# Altium schematic sheet PLL_PCB.SchDoc
size 863 x 558 mm
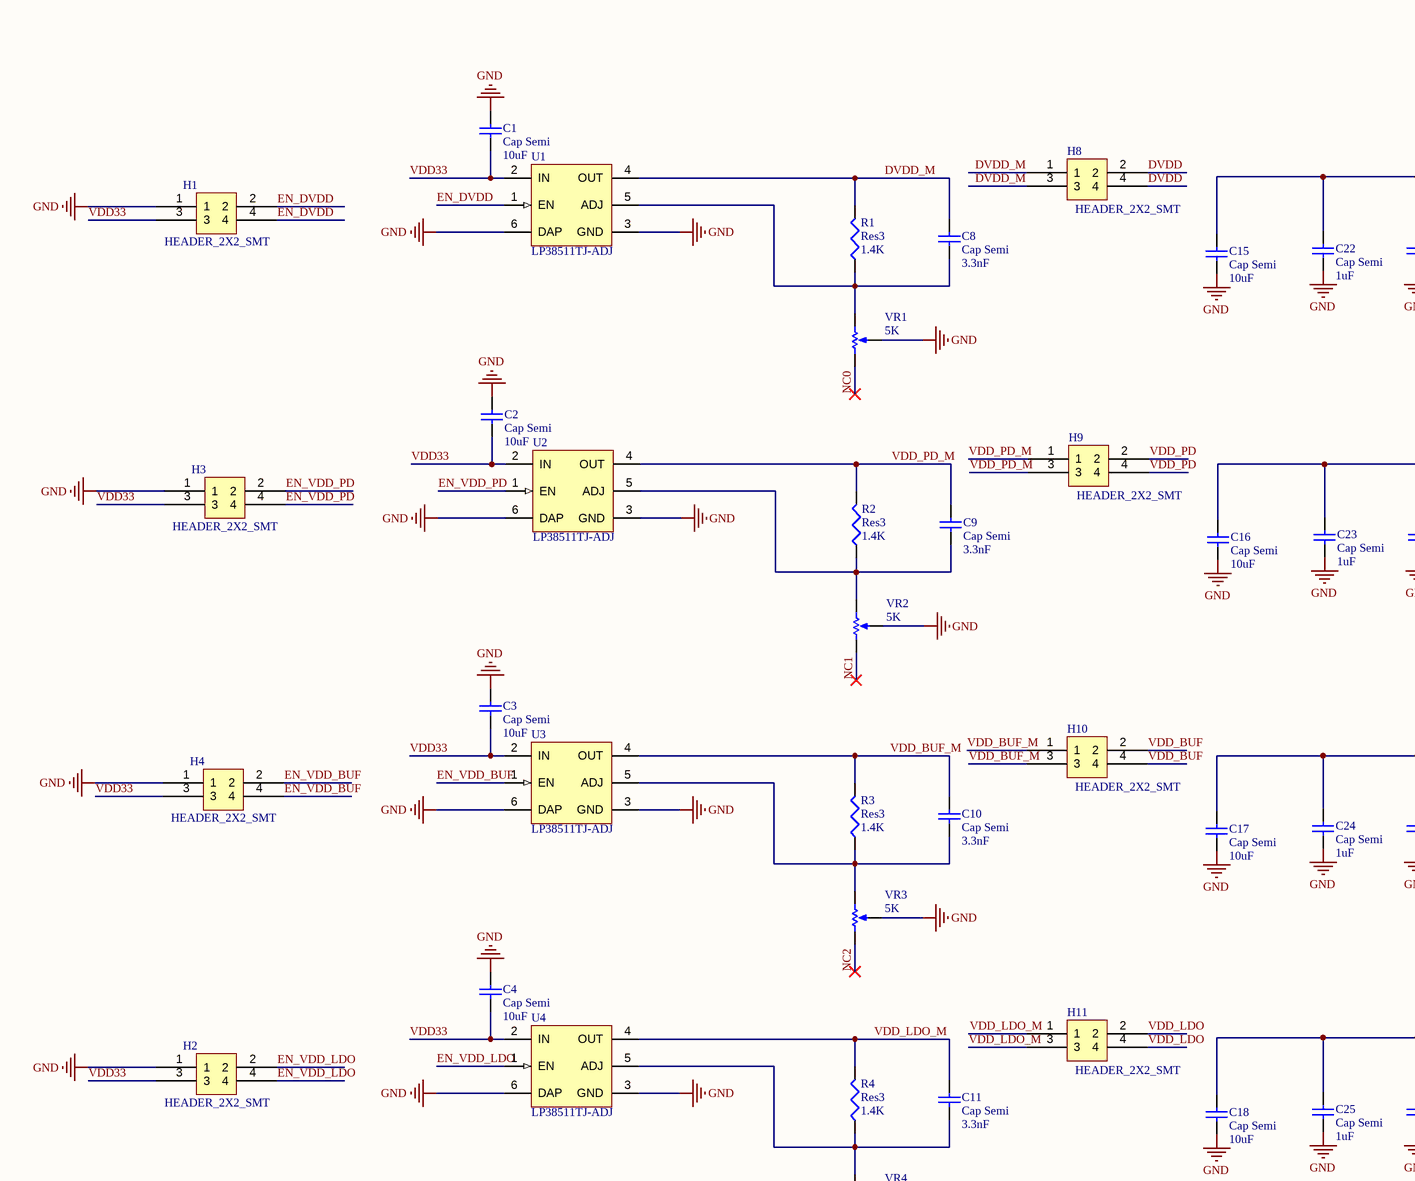
[diagram p0: PLL_PCB.SchDoc, top left]
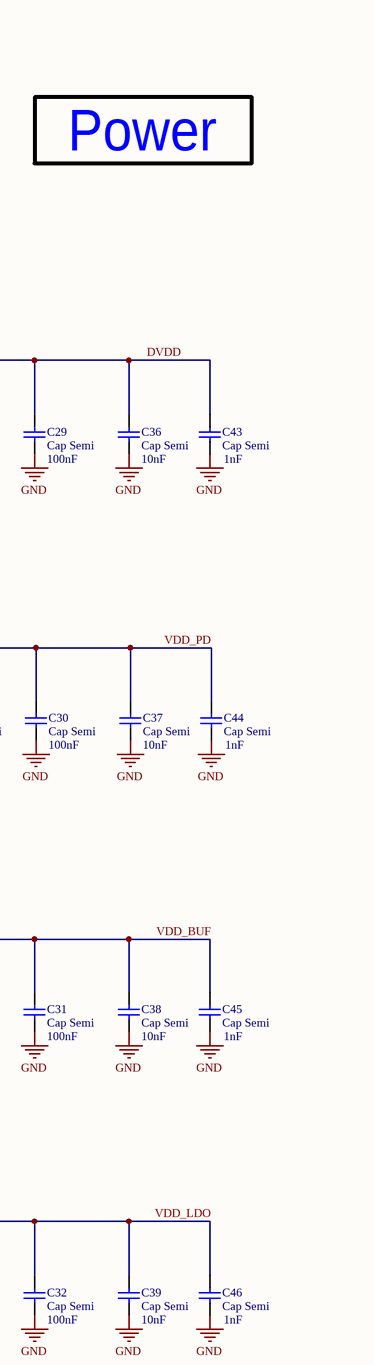
[diagram p1: PLL_PCB.SchDoc, top middle]
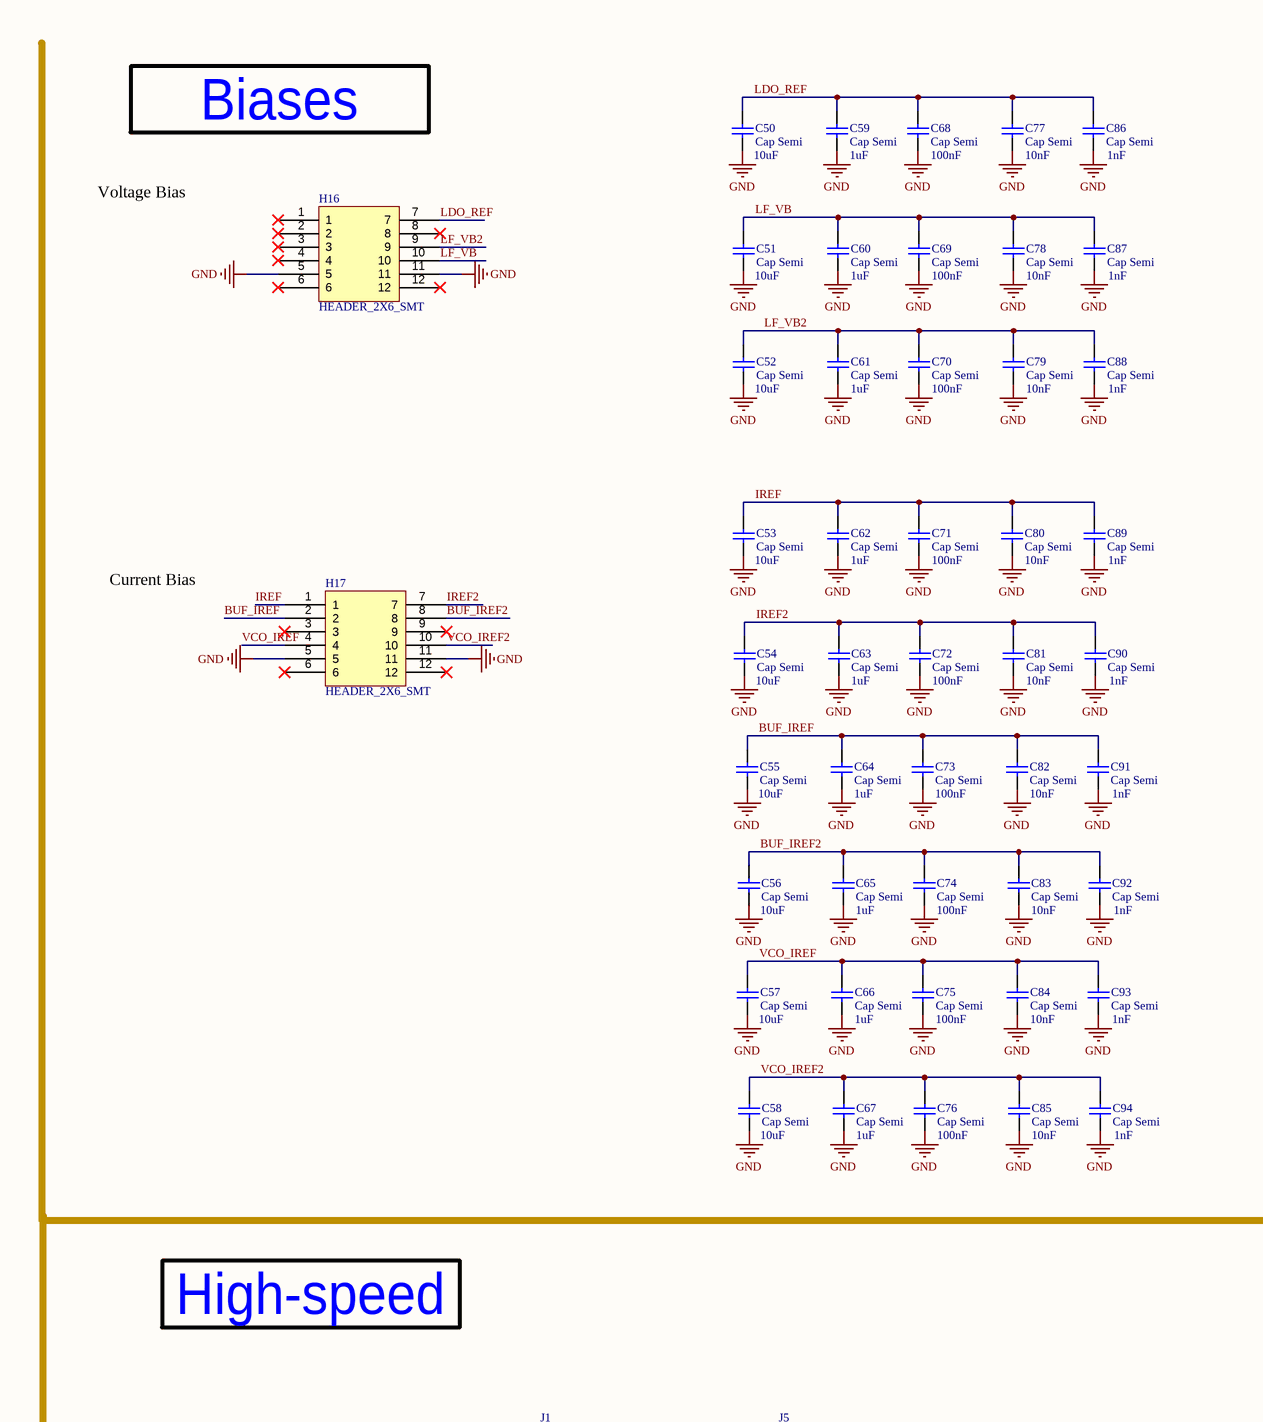
[diagram p2: PLL_PCB.SchDoc, top right]
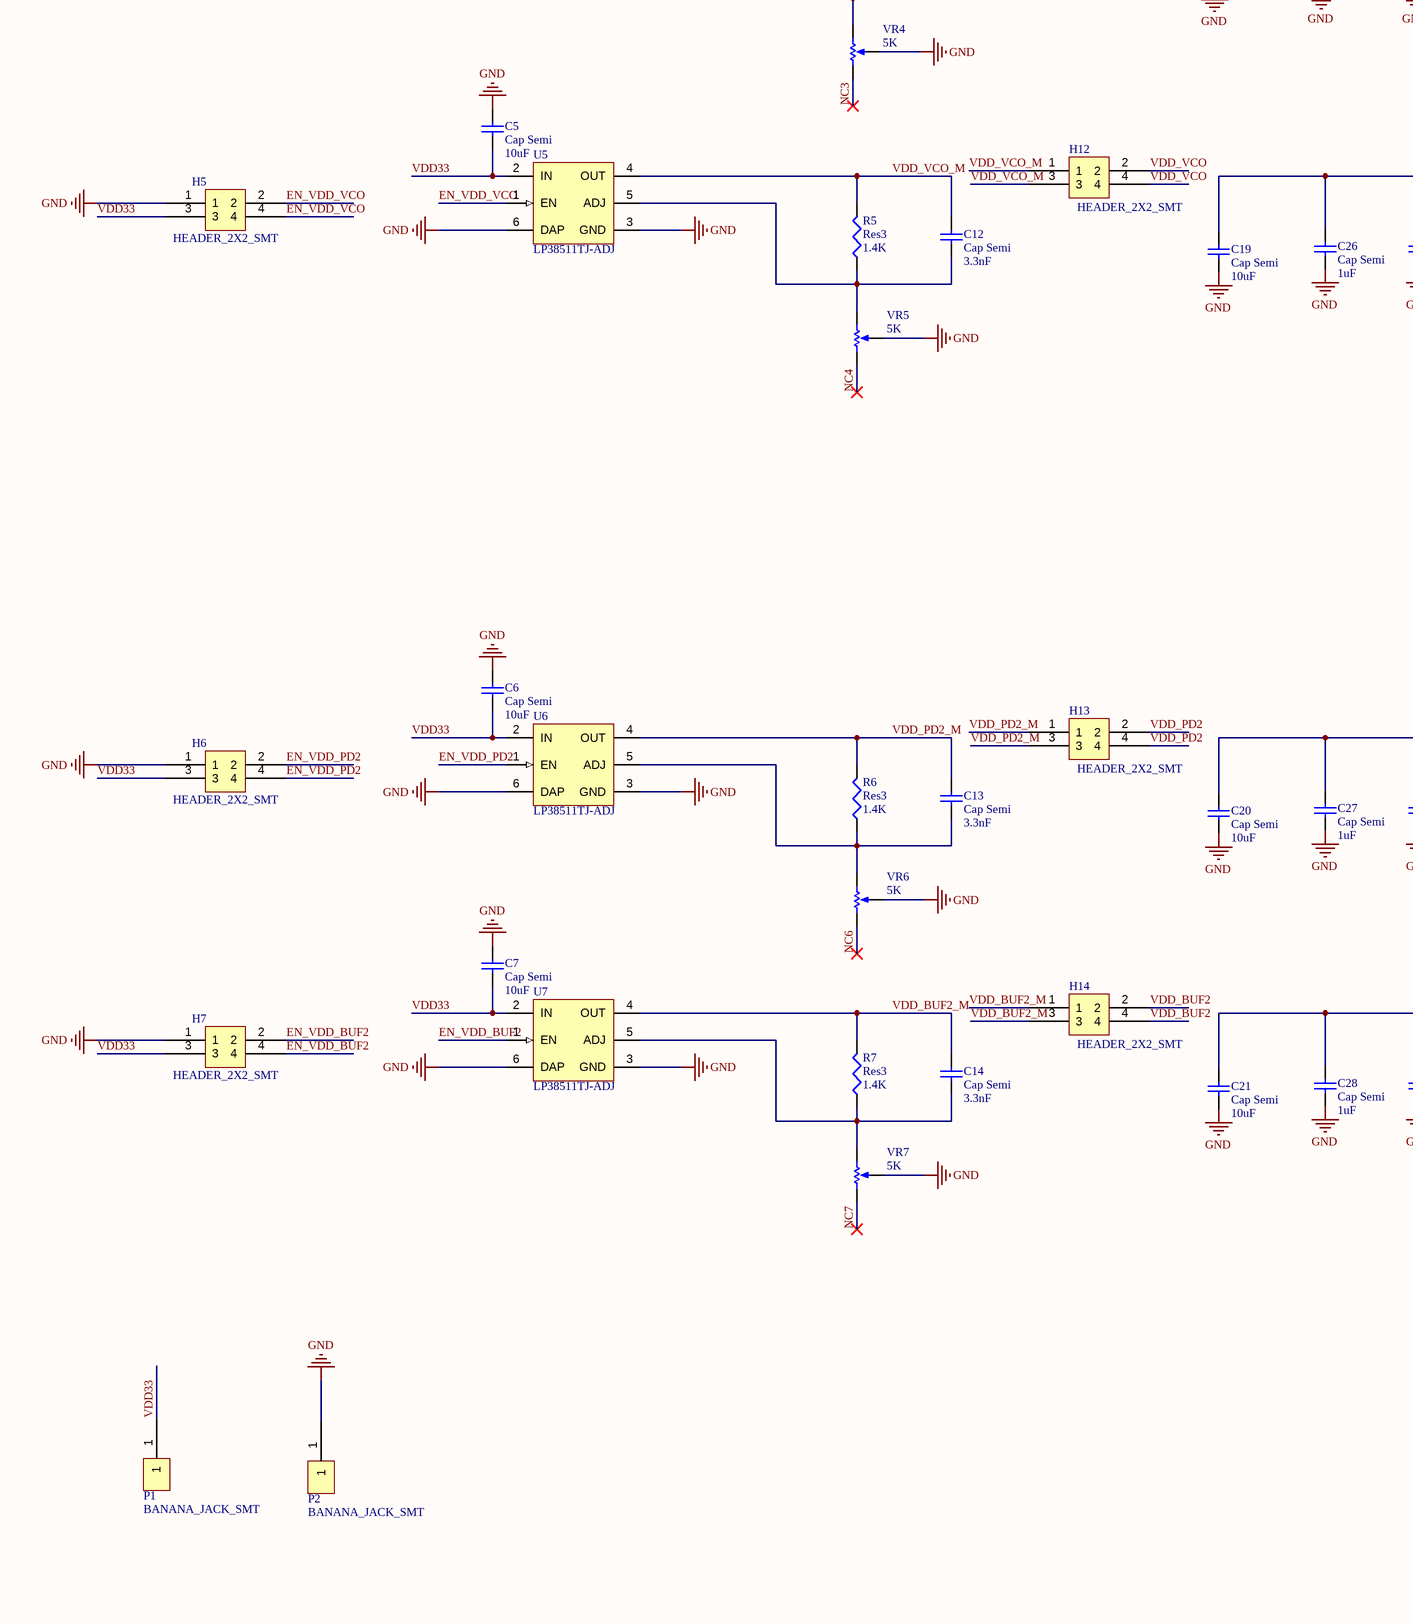
[diagram p3: PLL_PCB.SchDoc, bottom left]
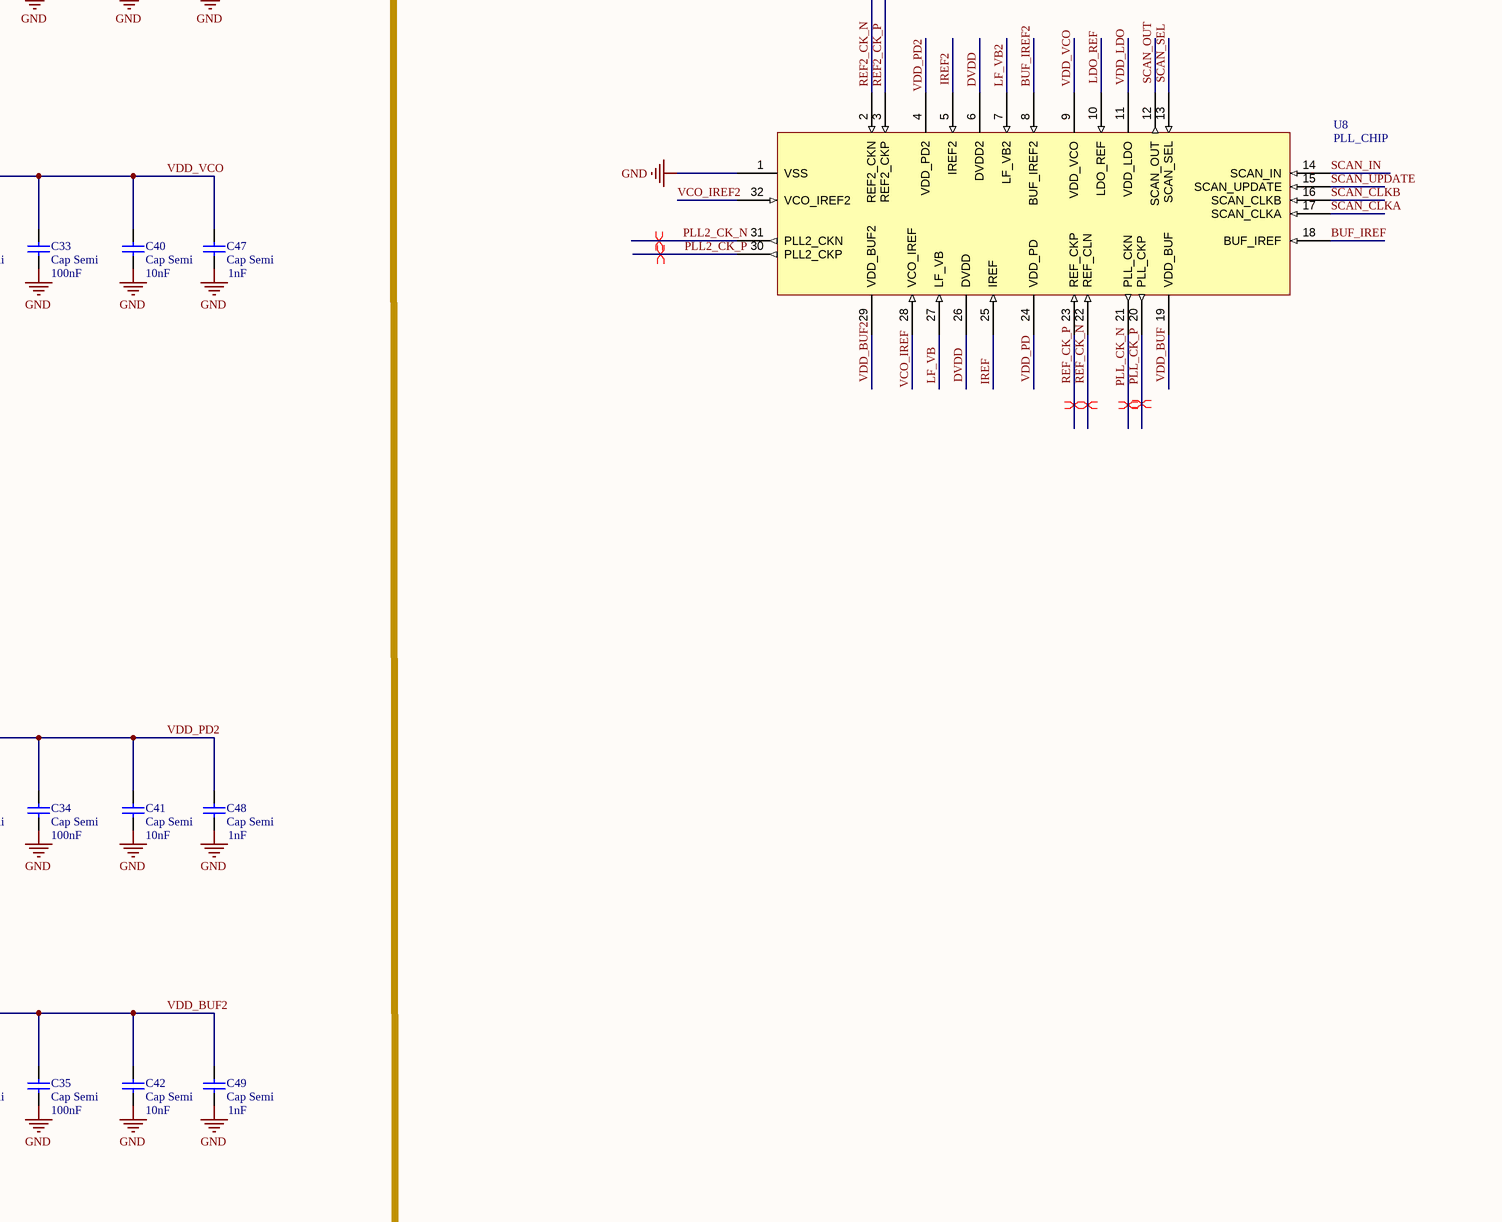
[diagram p4: PLL_PCB.SchDoc, bottom middle]
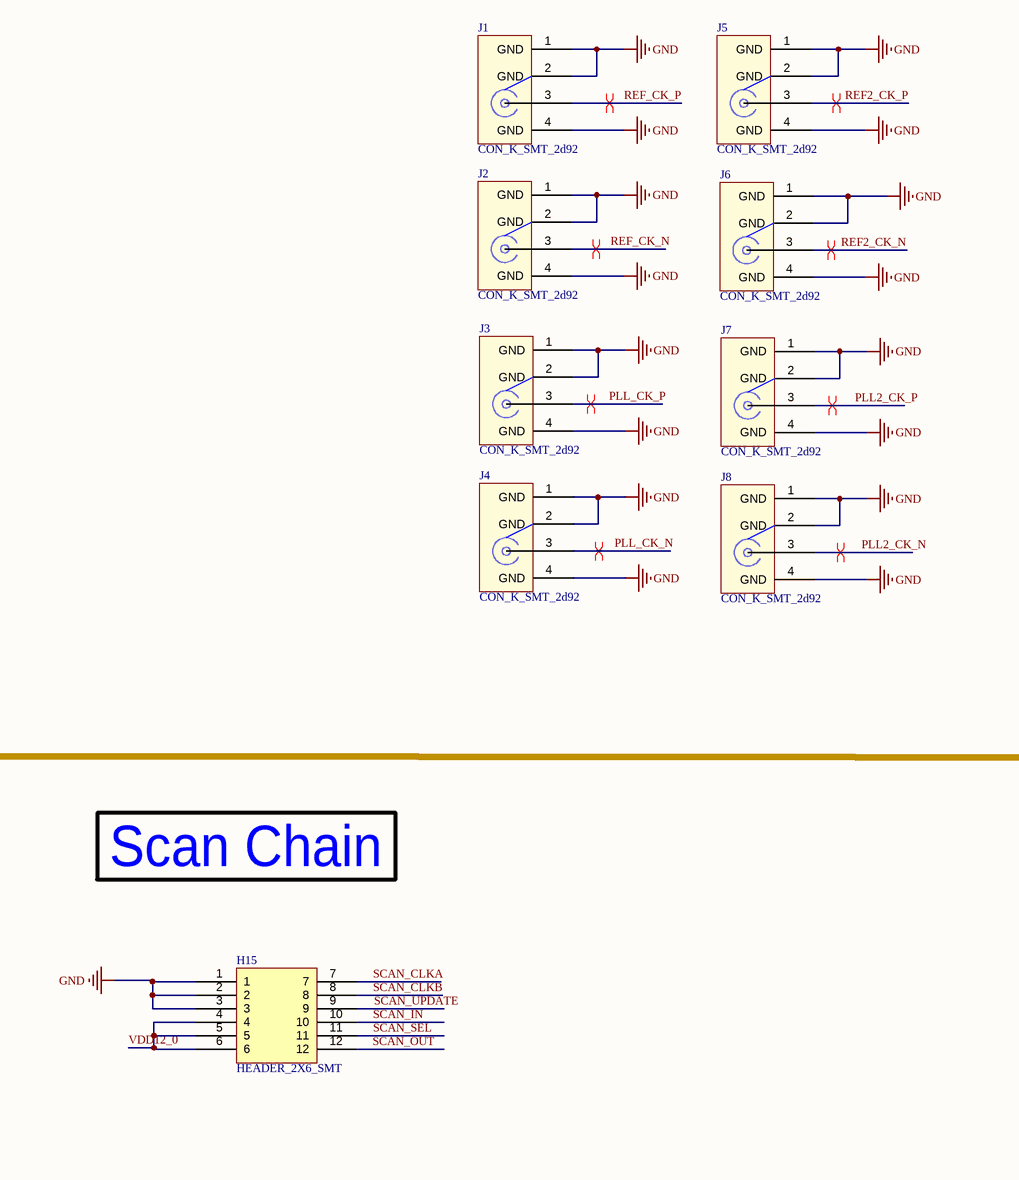
[diagram p5: PLL_PCB.SchDoc, bottom right]

## Parts
C1  Cap Semi  value 10uF  [1608[0603]]
C2  Cap Semi  value 10uF  [1608[0603]]
C3  Cap Semi  value 10uF  [1608[0603]]
C4  Cap Semi  value 10uF  [1608[0603]]
C5  Cap Semi  value 10uF  [1608[0603]]
C6  Cap Semi  value 10uF  [1608[0603]]
C7  Cap Semi  value 10uF  [1608[0603]]
C8  Cap Semi  value 3.3nF  [1608[0603]]
C9  Cap Semi  value 3.3nF  [1608[0603]]
C10  Cap Semi  value 3.3nF  [1608[0603]]
C11  Cap Semi  value 3.3nF  [1608[0603]]
C12  Cap Semi  value 3.3nF  [1608[0603]]
C13  Cap Semi  value 3.3nF  [1608[0603]]
C14  Cap Semi  value 3.3nF  [1608[0603]]
C15  Cap Semi  value 10uF  [0402]
C16  Cap Semi  value 10uF  [0402]
C17  Cap Semi  value 10uF  [0402]
C18  Cap Semi  value 10uF  [0402]
C19  Cap Semi  value 10uF  [0402]
C20  Cap Semi  value 10uF  [0402]
C21  Cap Semi  value 10uF  [0402]
C22  Cap Semi  value 1uF  [0402]
C23  Cap Semi  value 1uF  [0402]
C24  Cap Semi  value 1uF  [0402]
C25  Cap Semi  value 1uF  [0402]
C26  Cap Semi  value 1uF  [0402]
C27  Cap Semi  value 1uF  [0402]
C28  Cap Semi  value 1uF  [0402]
C29  Cap Semi  value 100nF  [0402]
C30  Cap Semi  value 100nF  [0402]
C31  Cap Semi  value 100nF  [0402]
C32  Cap Semi  value 100nF  [0402]
C33  Cap Semi  value 100nF  [0402]
C34  Cap Semi  value 100nF  [0402]
C35  Cap Semi  value 100nF  [0402]
C36  Cap Semi  value 10nF  [0402]
C37  Cap Semi  value 10nF  [0402]
C38  Cap Semi  value 10nF  [0402]
C39  Cap Semi  value 10nF  [0402]
C40  Cap Semi  value 10nF  [0402]
C41  Cap Semi  value 10nF  [0402]
C42  Cap Semi  value 10nF  [0402]
C43  Cap Semi  value 1nF  [0402]
C44  Cap Semi  value 1nF  [0402]
C45  Cap Semi  value 1nF  [0402]
C46  Cap Semi  value 1nF  [0402]
C47  Cap Semi  value 1nF  [0402]
C48  Cap Semi  value 1nF  [0402]
C49  Cap Semi  value 1nF  [0402]
C50  Cap Semi  value 10uF  [0402]
C51  Cap Semi  value 10uF  [0402]
C52  Cap Semi  value 10uF  [0402]
C53  Cap Semi  value 10uF  [0402]
C54  Cap Semi  value 10uF  [0402]
C55  Cap Semi  value 10uF  [0402]
C56  Cap Semi  value 10uF  [0402]
C57  Cap Semi  value 10uF  [0402]
C58  Cap Semi  value 10uF  [0402]
C59  Cap Semi  value 1uF  [0402]
C60  Cap Semi  value 1uF  [0402]
C61  Cap Semi  value 1uF  [0402]
C62  Cap Semi  value 1uF  [0402]
C63  Cap Semi  value 1uF  [0402]
C64  Cap Semi  value 1uF  [0402]
C65  Cap Semi  value 1uF  [0402]
C66  Cap Semi  value 1uF  [0402]
C67  Cap Semi  value 1uF  [0402]
C68  Cap Semi  value 100nF  [0402]
C69  Cap Semi  value 100nF  [0402]
C70  Cap Semi  value 100nF  [0402]
C71  Cap Semi  value 100nF  [0402]
C72  Cap Semi  value 100nF  [0402]
C73  Cap Semi  value 100nF  [0402]
C74  Cap Semi  value 100nF  [0402]
C75  Cap Semi  value 100nF  [0402]
C76  Cap Semi  value 100nF  [0402]
C77  Cap Semi  value 10nF  [0402]
C78  Cap Semi  value 10nF  [0402]
C79  Cap Semi  value 10nF  [0402]
C80  Cap Semi  value 10nF  [0402]
C81  Cap Semi  value 10nF  [0402]
C82  Cap Semi  value 10nF  [0402]
C83  Cap Semi  value 10nF  [0402]
C84  Cap Semi  value 10nF  [0402]
C85  Cap Semi  value 10nF  [0402]
C86  Cap Semi  value 1nF  [0402]
C87  Cap Semi  value 1nF  [0402]
C88  Cap Semi  value 1nF  [0402]
C89  Cap Semi  value 1nF  [0402]
C90  Cap Semi  value 1nF  [0402]
C91  Cap Semi  value 1nF  [0402]
C92  Cap Semi  value 1nF  [0402]
C93  Cap Semi  value 1nF  [0402]
C94  Cap Semi  value 1nF  [0402]
H1  HEADER_2X2_SMT  [HEADER_2X2_SMT]
H2  HEADER_2X2_SMT  [HEADER_2X2_SMT]
H3  HEADER_2X2_SMT  [HEADER_2X2_SMT]
H4  HEADER_2X2_SMT  [HEADER_2X2_SMT]
H5  HEADER_2X2_SMT  [HEADER_2X2_SMT]
H6  HEADER_2X2_SMT  [HEADER_2X2_SMT]
H7  HEADER_2X2_SMT  [HEADER_2X2_SMT]
H8  HEADER_2X2_SMT  [HEADER_2X2_SMT]
H9  HEADER_2X2_SMT  [HEADER_2X2_SMT]
H10  HEADER_2X2_SMT  [HEADER_2X2_SMT]
H11  HEADER_2X2_SMT  [HEADER_2X2_SMT]
H12  HEADER_2X2_SMT  [HEADER_2X2_SMT]
H13  HEADER_2X2_SMT  [HEADER_2X2_SMT]
H14  HEADER_2X2_SMT  [HEADER_2X2_SMT]
H15  HEADER_2X6_SMT  [HDR2X6_SMT]
H16  HEADER_2X6_SMT  [HDR2X6_SMT]
H17  HEADER_2X6_SMT  [HDR2X6_SMT]
J1  CON_K_SMT_2d92  [CON_K_SMT_2d92]
J2  CON_K_SMT_2d92  [CON_K_SMT_2d92]
J3  CON_K_SMT_2d92  [CON_K_SMT_2d92]
J4  CON_K_SMT_2d92  [CON_K_SMT_2d92]
J5  CON_K_SMT_2d92  [CON_K_SMT_2d92]
J6  CON_K_SMT_2d92  [CON_K_SMT_2d92]
J7  CON_K_SMT_2d92  [CON_K_SMT_2d92]
J8  CON_K_SMT_2d92  [CON_K_SMT_2d92]
P1  BANANA_JACK_SMT  [BANANA_JACK_SMT]
P2  BANANA_JACK_SMT  [BANANA_JACK_SMT]
R1  Res3  value 1.4K  [J1-0603]
R2  Res3  value 1.4K  [J1-0603]
R3  Res3  value 1.4K  [J1-0603]
R4  Res3  value 1.4K  [J1-0603]
R5  Res3  value 1.4K  [J1-0603]
R6  Res3  value 1.4K  [J1-0603]
R7  Res3  value 1.4K  [J1-0603]
U1  LP38511TJ-ADJ  [TJ5A_N]
U2  LP38511TJ-ADJ  [TJ5A_N]
U3  LP38511TJ-ADJ  [TJ5A_N]
U4  LP38511TJ-ADJ  [TJ5A_N]
U5  LP38511TJ-ADJ  [TJ5A_N]
U6  LP38511TJ-ADJ  [TJ5A_N]
U7  LP38511TJ-ADJ  [TJ5A_N]
U8  PLL_CHIP  [PLL_CHIP]
VR1  5K  [PV36]
VR2  5K  [PV36]
VR3  5K  [PV36]
VR4  5K  [PV36]
VR5  5K  [PV36]
VR6  5K  [PV36]
VR7  5K  [PV36]

## Nets
GND: C1.1 C2.1 C3.1 C4.1 C5.1 C6.1 C7.1 C15.1 C16.1 C17.1 C18.1 C19.1 C20.1 C21.1 C22.1 C23.1 C24.1 C25.1 C26.1 C27.1 C28.1 C29.1 C30.1 C31.1 C32.1 C33.1 C34.1 C35.1 C36.1 C37.1 C38.1 C39.1 C40.1 C41.1 C42.1 C43.1 C44.1 C45.1 C46.1 C47.1 C48.1 C49.1 C50.1 C51.1 C52.1 C53.1 C54.1 C55.1 C56.1 C57.1 C58.1 C59.1 C60.1 C61.1 C62.1 C63.1 C64.1 C65.1 C66.1 C67.1 C68.1 C69.1 C70.1 C71.1 C72.1 C73.1 C74.1 C75.1 C76.1 C77.1 C78.1 C79.1 C80.1 C81.1 C82.1 C83.1 C84.1 C85.1 C86.1 C87.1 C88.1 C89.1 C90.1 C91.1 C92.1 C93.1 C94.1 H1.1 H2.1 H3.1 H4.1 H5.1 H6.1 H7.1 H15.1 H15.2 H15.3 H16.5 H16.11 H17.5 H17.11 J1.1(GND) J1.2(GND) J1.4(GND) J2.1(GND) J2.2(GND) J2.4(GND) J3.1(GND) J3.2(GND) J3.4(GND) J4.1(GND) J4.2(GND) J4.4(GND) J5.1(GND) J5.2(GND) J5.4(GND) J6.1(GND) J6.2(GND) J6.4(GND) J7.1(GND) J7.2(GND) J7.4(GND) J8.1(GND) J8.2(GND) J8.4(GND) P2.1 U1.3(GND) U1.6(DAP) U2.3(GND) U2.6(DAP) U3.3(GND) U3.6(DAP) U4.3(GND) U4.6(DAP) U5.3(GND) U5.6(DAP) U6.3(GND) U6.6(DAP) U7.3(GND) U7.6(DAP) U8.1(VSS) VR1.2(TAP) VR2.2(TAP) VR3.2(TAP) VR4.2(TAP) VR5.2(TAP) VR6.2(TAP) VR7.2(TAP)
BUF_IREF: C55.2 C64.2 C73.2 C82.2 C91.2 H17.2 U8.18(BUF_IREF)
BUF_IREF2: C56.2 C65.2 C74.2 C83.2 C92.2 H17.8 U8.8(BUF_IREF2)
DVDD: C15.2 C22.2 C29.2 C36.2 C43.2 H8.2 H8.4 U8.6(DVDD2) U8.26(DVDD)
DVDD_M: C8.2 H8.1 H8.3 R1.2 U1.4(OUT)
EN_DVDD: H1.2 H1.4 U1.1(EN)
EN_VDD_BUF: H4.2 H4.4 U3.1(EN)
EN_VDD_BUF2: H7.2 H7.4 U7.1(EN)
EN_VDD_LDO: H2.2 H2.4 U4.1(EN)
EN_VDD_PD: H3.2 H3.4 U2.1(EN)
EN_VDD_PD2: H6.2 H6.4 U6.1(EN)
EN_VDD_VCO: H5.2 H5.4 U5.1(EN)
IREF: C53.2 C62.2 C71.2 C80.2 C89.2 H17.1 U8.25(IREF)
IREF2: C54.2 C63.2 C72.2 C81.2 C90.2 H17.7 U8.5(IREF2)
LDO_REF: C50.2 C59.2 C68.2 C77.2 C86.2 H16.7 U8.10(LDO_REF)
LF_VB: C51.2 C60.2 C69.2 C78.2 C87.2 H16.10 U8.27(LF_VB)
LF_VB2: C52.2 C61.2 C70.2 C79.2 C88.2 H16.9 U8.7(LF_VB2)
NC0: VR1.1(TOP)
NC1: VR2.1(TOP)
NC2: VR3.1(TOP)
NC3: VR4.1(TOP)
NC4: VR5.1(TOP)
NC6: VR6.1(TOP)
NC7: VR7.1(TOP)
PLL2_CK_N: J8.3 U8.31(PLL2_CKN)
PLL2_CK_P: J7.3 U8.30(PLL2_CKP)
PLL_CK_N: J4.3 U8.21(PLL_CKN)
PLL_CK_P: J3.3 U8.20(PLL_CKP)
REF2_CK_N: J6.3 U8.2(REF2_CKN)
REF2_CK_P: J5.3 U8.3(REF2_CKP)
REF_CK_N: J2.3 U8.22(REF_CLN)
REF_CK_P: J1.3 U8.23(REF_CKP)
SCAN_CLKA: H15.7 U8.17(SCAN_CLKA)
SCAN_CLKB: H15.8 U8.16(SCAN_CLKB)
SCAN_IN: H15.10 U8.14(SCAN_IN)
SCAN_OUT: H15.12 U8.12(SCAN_OUT)
SCAN_SEL: H15.11 U8.13(SCAN_SEL)
SCAN_UPDATE: H15.9 U8.15(SCAN_UPDATE)
VCO_IREF: C57.2 C66.2 C75.2 C84.2 C93.2 H17.4 U8.28(VCO_IREF)
VCO_IREF2: C58.2 C67.2 C76.2 C85.2 C94.2 H17.10 U8.32(VCO_IREF2)
VDD12_0: H15.4 H15.5 H15.6
VDD33: C1.2 C2.2 C3.2 C4.2 C5.2 C6.2 C7.2 H1.3 H2.3 H3.3 H4.3 H5.3 H6.3 H7.3 P1.1 U1.2(IN) U2.2(IN) U3.2(IN) U4.2(IN) U5.2(IN) U6.2(IN) U7.2(IN)
VDD_BUF: C17.2 C24.2 C31.2 C38.2 C45.2 H10.2 H10.4 U8.19(VDD_BUF)
VDD_BUF2: C21.2 C28.2 C35.2 C42.2 C49.2 H14.2 H14.4 U8.29(VDD_BUF2)
VDD_BUF2_M: C14.2 H14.1 H14.3 R7.2 U7.4(OUT)
VDD_BUF_M: C10.2 H10.1 H10.3 R3.2 U3.4(OUT)
VDD_LDO: C18.2 C25.2 C32.2 C39.2 C46.2 H11.2 H11.4 U8.11(VDD_LDO)
VDD_LDO_M: C11.2 H11.1 H11.3 R4.2 U4.4(OUT)
VDD_PD: C16.2 C23.2 C30.2 C37.2 C44.2 H9.2 H9.4 U8.24(VDD_PD)
VDD_PD2: C20.2 C27.2 C34.2 C41.2 C48.2 H13.2 H13.4 U8.4(VDD_PD2)
VDD_PD2_M: C13.2 H13.1 H13.3 R6.2 U6.4(OUT)
VDD_PD_M: C9.2 H9.1 H9.3 R2.2 U2.4(OUT)
VDD_VCO: C19.2 C26.2 C33.2 C40.2 C47.2 H12.2 H12.4 U8.9(VDD_VCO)
VDD_VCO_M: C12.2 H12.1 H12.3 R5.2 U5.4(OUT)
NetC8_1: C8.1 R1.1 U1.5(ADJ) VR1.3(BOT)
NetC9_1: C9.1 R2.1 U2.5(ADJ) VR2.3(BOT)
NetC10_1: C10.1 R3.1 U3.5(ADJ) VR3.3(BOT)
NetC11_1: C11.1 R4.1 U4.5(ADJ) VR4.3(BOT)
NetC12_1: C12.1 R5.1 U5.5(ADJ) VR5.3(BOT)
NetC13_1: C13.1 R6.1 U6.5(ADJ) VR6.3(BOT)
NetC14_1: C14.1 R7.1 U7.5(ADJ) VR7.3(BOT)

Not connected (* = marked no-connect by the designer): H16 1* 2* 3* 4* 6* 8* 12*; H17 3* 6* 9* 12*

## Layout directives
differential pair: PLL2_CK_N, PLL2_CK_P, PLL_CK_N, PLL_CK_P, REF2_CK_N, REF2_CK_P, REF_CK_N, REF_CK_P

## Notes on the sheet
- Biases
- Power
- Voltage Bias
- Current Bias
- High-speed signals
- Scan Chain
- DWG. NO.
- REV.
- SHT.
- REVISION
- DESCRIPTION
- DATE
- APPROVED
- THIS DOCUMENT AND THE DATA DISCLOSED HEREIN OR HEREWITH IS THE PROPERTY OF ALTIUM LIMITED AND MAY BE FREELY DISTRIBUTED IN WHOLE. NO RIGHTS ARE RESERVED OR EXPRESS OR IMPLIED WARANTEE GIVEN.
- ENG:
- DSN:
- APPROVALS
- PROJECT
- DOCUMENT REVISION:
- DESIGN ITEM:
- CHK:
- BOM:
- REFERENCE DOCUMENTS
- PROJECT REVISION:
- TITLE
- FAB DWG:
- PCB DWG:
- ASSY DWG:
- SCALE:
- SIZE
- D
- CAGE CODE
- FILE NAME
- DWG NO.
- SHEET
- OF
- REV

## Library data of the parts
C1-C94 = Cap Semi: Capacitor (Semiconductor SIM Model); Published: 8-Jun-2000; LatestRevisionDate: 29-May-2009; LatestRevisionNote: IPC-7351 Footprint Added.; PackageReference: C1206; Publisher: Altium Limited; PackageDescription: Chip Capacitor
J1-J8 = CON_K_SMT_2d92: Con RF K
R1-R7 = Res3: Resistor; Published: 8-Jun-2000; LatestRevisionDate: 29-May-2009; LatestRevisionNote: IPC-7351 Footprint Added.; PackageReference: J1-0603; Publisher: Altium Limited; PackageDescription: Chip Resistor
U1-U7 = LP38511TJ-ADJ: 800 mA Fast-Transient Response Low-Dropout Linear Voltage Regulator with Error Flag, 6-pin TO-263 Thin; Manufacturer: National Semiconductor; PackageTopMarking: NSUZXYTTE#*LP38511*TJ-ADJ; PowerWise: N; CompType: LDO IC; High-Reliability: Y; DatasheetVersion: Feb-2009; PackageVersion: revE, Jan-2008; PackageReference: TJ5A; PackageDescription: Thin TO-263, Molded, 9.85 x 10.16 x 2mm Body, 5 Lead, 1.7mm Pitch, Surface Mount; PartNumber: LP38511TJ-ADJ; RoHS: Y; PinCount: 5; ComponentLink1Description: Manufacturer URL; ComponentLink1URL: http://www.national.com/; ComponentLink2Description: LP38511 Datasheet; ComponentLink2URL: http://www.national.com/ds/LP/LP38511-ADJ.pdf; ComponentLink3Description: LP38511 Web Page; ComponentLink3URL: http://www.national.com/pf/LP/LP38511.html; ComponentLink4Description: TJ5A Package Page; ComponentLink4URL: http://www.national.com/packaging/folders/tj5a.html
VR1-VR7 = RPot_5K: Potentiometer; Manufacturer: Bourns; Manufacturer ID: 3214X-1-502E; Digikey ID: 3214X-1-502ECT-ND